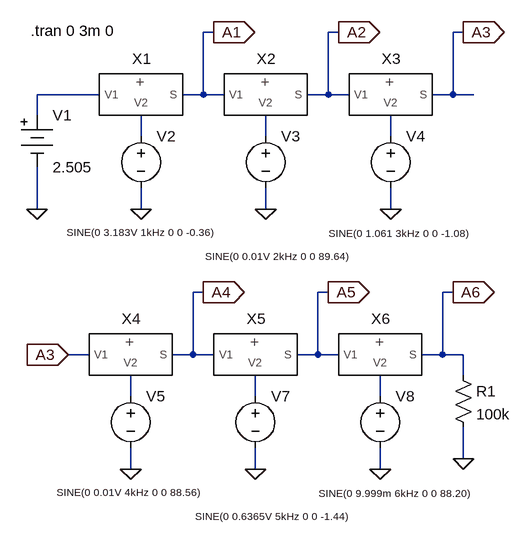
[diagram p0: schematic E5-2-Arm1-a-6.asc]
E5-2-Arm1-a-6.asc, the LTspice schematic file:
Version 4
SHEET 1 1008 680
WIRE -192 -480 -208 -480
WIRE 0 -480 -16 -480
WIRE 192 -480 176 -480
WIRE -368 -384 -464 -384
WIRE -208 -384 -208 -480
WIRE -208 -384 -240 -384
WIRE -176 -384 -208 -384
WIRE -16 -384 -16 -480
WIRE -16 -384 -48 -384
WIRE 16 -384 -16 -384
WIRE 176 -384 176 -480
WIRE 176 -384 144 -384
WIRE 208 -384 176 -384
WIRE -464 -352 -464 -384
WIRE -304 -320 -304 -352
WIRE -112 -320 -112 -352
WIRE 80 -320 80 -352
WIRE -464 -208 -464 -272
WIRE -304 -208 -304 -240
WIRE -112 -208 -112 -240
WIRE 80 -208 80 -240
WIRE -208 -80 -224 -80
WIRE -16 -80 -32 -80
WIRE 176 -80 160 -80
WIRE -384 16 -416 16
WIRE -224 16 -224 -80
WIRE -224 16 -256 16
WIRE -192 16 -224 16
WIRE -32 16 -32 -80
WIRE -32 16 -64 16
WIRE 0 16 -32 16
WIRE 160 16 160 -80
WIRE 160 16 128 16
WIRE 192 16 160 16
WIRE 192 48 192 16
WIRE -320 80 -320 48
WIRE -128 80 -128 48
WIRE 64 80 64 48
WIRE 192 176 192 128
WIRE -320 192 -320 160
WIRE -128 192 -128 160
WIRE 64 192 64 160
FLAG -464 -208 0
FLAG -304 -208 0
FLAG -112 -208 0
FLAG 80 -208 0
FLAG -192 -480 A1
IOPIN -192 -480 Out
FLAG 0 -480 A2
IOPIN 0 -480 Out
FLAG 192 -480 A3
IOPIN 192 -480 Out
FLAG -320 192 0
FLAG -128 192 0
FLAG 64 192 0
FLAG -208 -80 A4
IOPIN -208 -80 Out
FLAG -16 -80 A5
IOPIN -16 -80 Out
FLAG 176 -80 A6
IOPIN 176 -80 Out
FLAG -416 16 A3
IOPIN -416 16 In
FLAG 192 176 0
SYMBOL voltage -304 -336 R0
WINDOW 3 -114 164 Left 1
WINDOW 123 0 0 Left 0
WINDOW 39 0 0 Left 0
SYMATTR Value SINE(0 3.183V 1kHz 0 0 -0.36)
SYMATTR InstName V2
SYMBOL Misc\\battery -464 -368 R0
SYMATTR InstName V1
SYMATTR Value 2.505
SYMBOL Mis_Componentes\\E7-sumador-analogico -304 -384 R0
SYMATTR InstName X1
SYMBOL Mis_Componentes\\E7-sumador-analogico -112 -384 R0
SYMATTR InstName X2
SYMBOL Mis_Componentes\\E7-sumador-analogico 80 -384 R0
SYMATTR InstName X3
SYMBOL voltage -112 -336 R0
WINDOW 3 -93 201 Left 1
WINDOW 123 0 0 Left 0
WINDOW 39 0 0 Left 0
SYMATTR Value SINE(0 0.01V 2kHz 0 0 89.64)
SYMATTR InstName V3
SYMBOL voltage 80 -336 R0
WINDOW 3 -95 165 Left 1
WINDOW 123 0 0 Left 0
WINDOW 39 0 0 Left 0
SYMATTR Value SINE(0 1.061 3kHz 0 0 -1.08)
SYMATTR InstName V4
SYMBOL res 176 32 R0
SYMATTR InstName R1
SYMATTR Value 100k
SYMBOL voltage -320 64 R0
WINDOW 3 -114 164 Left 1
WINDOW 123 0 0 Left 0
WINDOW 39 0 0 Left 0
SYMATTR Value SINE(0 0.01V 4kHz 0 0 88.56)
SYMATTR InstName V5
SYMBOL Mis_Componentes\\E7-sumador-analogico -320 16 R0
SYMATTR InstName X4
SYMBOL Mis_Componentes\\E7-sumador-analogico -128 16 R0
SYMATTR InstName X5
SYMBOL Mis_Componentes\\E7-sumador-analogico 64 16 R0
SYMATTR InstName X6
SYMBOL voltage -128 64 R0
WINDOW 3 -93 201 Left 1
WINDOW 123 0 0 Left 0
WINDOW 39 0 0 Left 0
SYMATTR Value SINE(0 0.6365V 5kHz 0 0 -1.44)
SYMATTR InstName V7
SYMBOL voltage 64 64 R0
WINDOW 3 -95 165 Left 1
WINDOW 123 0 0 Left 0
WINDOW 39 0 0 Left 0
SYMATTR Value SINE(0 9.999m 6kHz 0 0 88.20)
SYMATTR InstName V8
TEXT -474 -482 Left 2 !.tran 0 3m 0

The netlist it stands for:
* E5-2-Arm1-a-6.asc
V2 N002 0 SINE(0 3.183V 1kHz 0 0 -0.36)
V1 N001 0 2.505
XX1 N001 N002 A1 E7-sumador-analogico  ; pins V1 V2 S
XX2 A1 N003 A2 E7-sumador-analogico  ; pins V1 V2 S
XX3 A2 N004 A3 E7-sumador-analogico  ; pins V1 V2 S
V3 N003 0 SINE(0 0.01V 2kHz 0 0 89.64)
V4 N004 0 SINE(0 1.061 3kHz 0 0 -1.08)
R1 A6 0 100k
V5 N005 0 SINE(0 0.01V 4kHz 0 0 88.56)
XX4 A3 N005 A4 E7-sumador-analogico  ; pins V1 V2 S
XX5 A4 N006 A5 E7-sumador-analogico  ; pins V1 V2 S
XX6 A5 N007 A6 E7-sumador-analogico  ; pins V1 V2 S
V7 N006 0 SINE(0 0.6365V 5kHz 0 0 -1.44)
V8 N007 0 SINE(0 9.999m 6kHz 0 0 88.20)
.tran 0 3m 0
.backanno
.end